# EAGLE design ina219 (EAGLE 9.3.0)
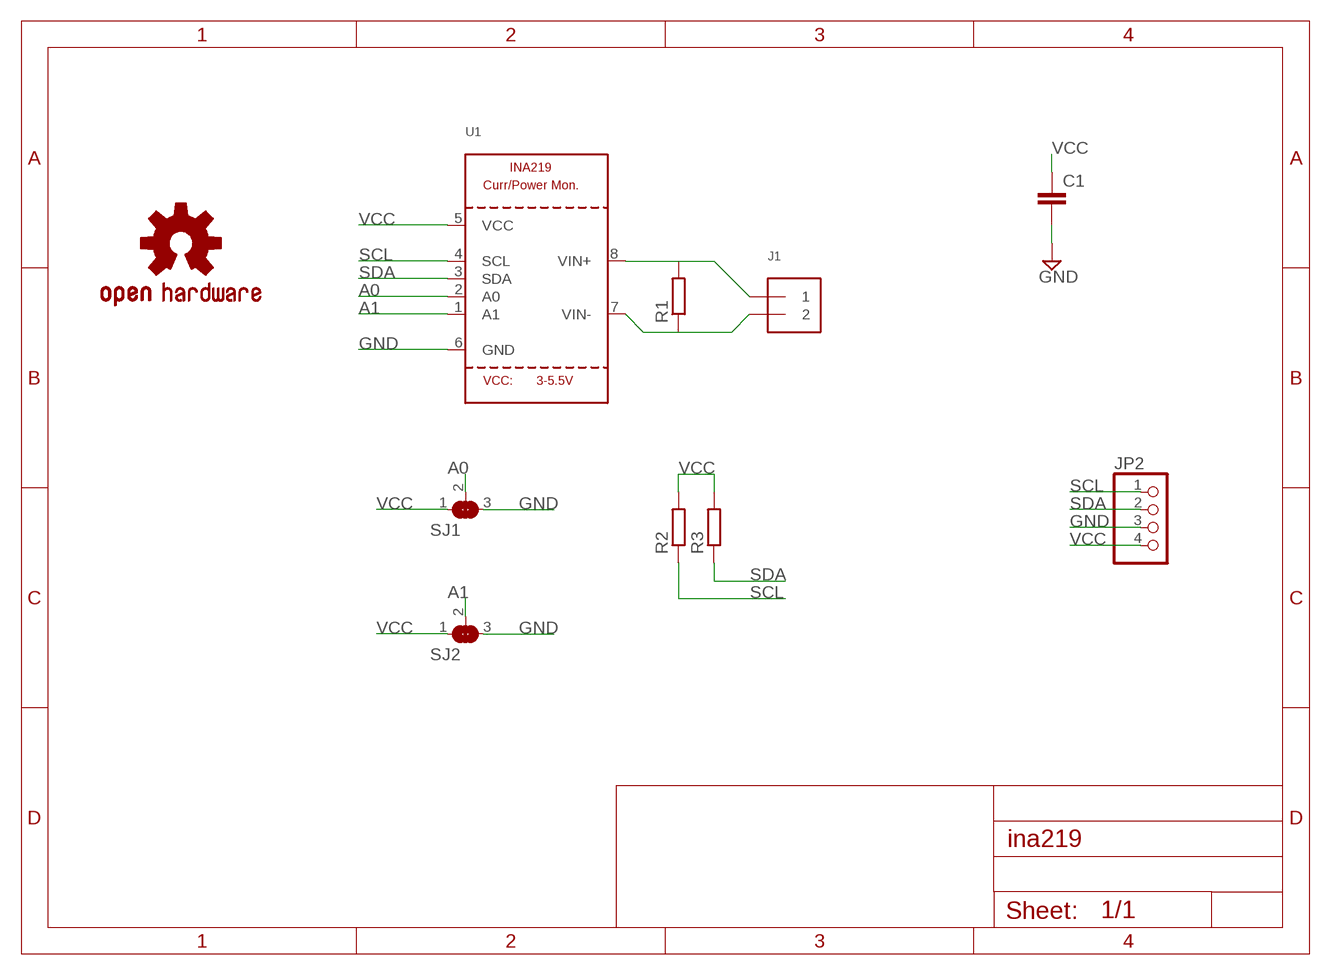
[diagram p0: schematic, sheet 1]

## Parts
C1  C-EUC0805  [C0805]
J1  TERMBLOCK_1X2  [TERMBLOCK_1X2-3.5MM]
JP2  PINHD-1X4  [1X04]
LOGO1  OSHW-LOGOS  [OSHW-LOGO-S]
R1  R-EU_R1206  [R1206]
R2  R-EU_R0805  [R0805]
R3  R-EU_R0805  [R0805]
SJ1  SOLDERJUMPER_2WAY0603  [SOLDERJUMPER_2WAY_OPEN_0603]
SJ2  SOLDERJUMPER_2WAY0603  [SOLDERJUMPER_2WAY_OPEN_0603]
U1  INA219SOIC8  [SOIC8_150MIL]

## Nets
A0: SJ1.2 U1.2(A0)
A1: SJ2.2 U1.1(A1)
GND: C1.2 JP2.3 SJ1.3 SJ2.3 U1.6(GND)
N$7: J1.1 R1.2 U1.8(VIN+)
N$8: J1.2 R1.1 U1.7(VIN-)
SCL: JP2.1 R2.1 U1.4(SCL)
SDA: JP2.2 R3.1 U1.3(SDA)
VCC: C1.1 JP2.4 R2.2 R3.2 SJ1.1 SJ2.1 U1.5(VCC)

## Library data of the parts
C1 = rcl:C-EU: CAPACITOR, European symbol
J1 = microbuilder:TERMBLOCK_1X2: 3.5mm Terminal block http://www.ladyada.net/library/pcb/eaglelibrary.html
JP2 = pinhead:PINHD-1X4: PIN HEADER
LOGO1 = SparkFun-Aesthetics:OSHW-LOGO: Open Source Hardware Logo This logo indicates the piece of hardware it is found on incorporates a OSHW license and/or adheres to the definition of open source hardware found here: http://freedomdefined.org/OSHW
R1-R3 = rcl:R-EU_: RESISTOR, European symbol
SJ1 SJ2 = microbuilder:SOLDERJUMPER_2WAY: 2-Way Solder Jumper
U1 = microbuilder:INA219: INA219 - I2C Current/Power Monitor Voltage Range: 0-26V Accuracy: 0.5% Temperature: -40°C - 125°C

## Board
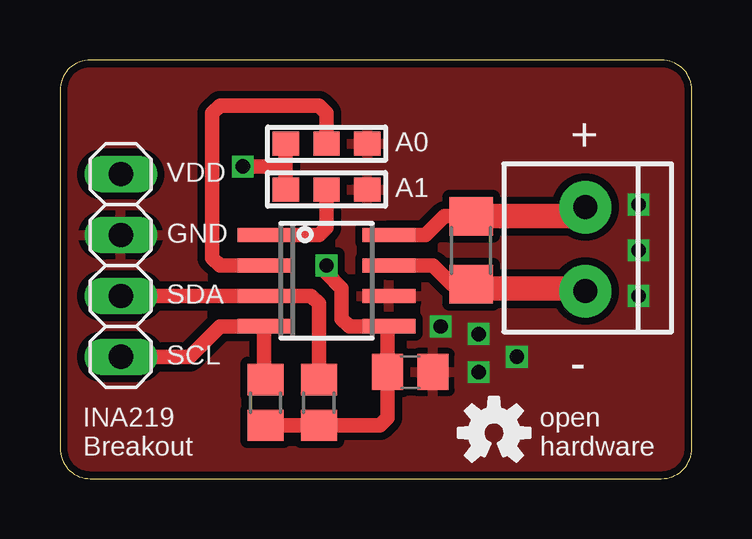
[diagram p1: board, top side]
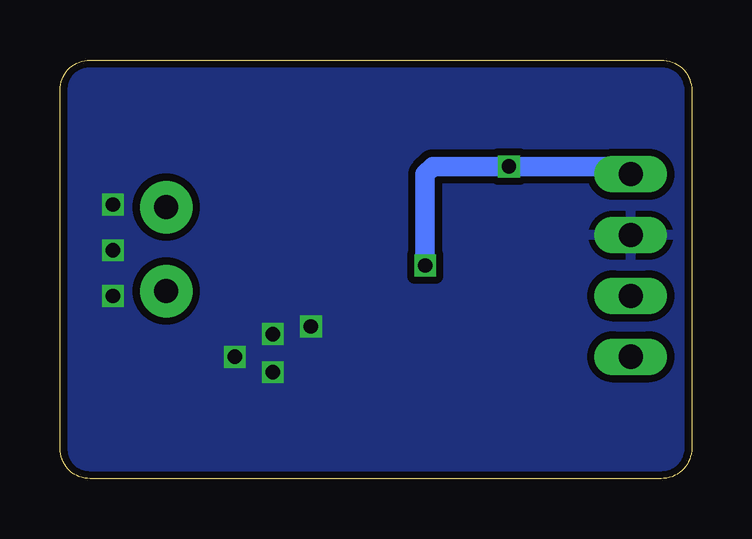
[diagram p2: board, bottom side, seen from below]

Size 26.34 x 17.46 mm. Coordinates in mm from the lower left corner, seen from the top.
Outline: 0,1.27 arc90 1.27,0 25.08,0 arc90 26.34,1.26 26.34,16.2 arc90 25.08,17.46 1.27,17.46 arc90 0,16.19 0,1.27
Copper layers (1*16): Top 0.035mm / dielectric 1.5mm / Bottom 0.035mm
Design rules "Fusion_eagle_rule_v1.1": minimum track width 6mil, minimum drill 12mil, track to track 6mil, track to pad 6mil, pad to pad 6mil, via to via 6mil, smd to smd 0mil, copper to edge 10mil, drill to drill 10mil, minimum pad ring 10mil, minimum via ring 6mil, stop-mask expansion 2mil, vias tented up to drill 100mil, thermal gap 10mil

### Footprints (pad centres in the part's own frame; a part is rotated, then mirrored left to right if it is on the bottom)
C0805 = smd 1.3 x 1.5: 1 -0.95,0; 2 0.95,0
TERMBLOCK_1X2-3.5MM = drill 1 pad 2.184: 1 1.8,0; 2 -1.7,0
1X04 = drill 1.016 long: 1 -3.81,0; 2 -1.27,0; 3 1.27,0; 4 3.81,0
R1206 = smd 1.6 x 1.803: 1 -1.422,0; 2 1.422,0
R0805 = smd 1.3 x 1.5: 1 -0.95,0; 2 0.95,0
SOLDERJUMPER_2WAY_OPEN_0603 = smd 1.1 x 1: 1 -1.7,0; 2 0,0; 3 1.7,0
SOIC8_150MIL = smd 0.6 x 2.2: 1 -1.905,-2.6; 2 -0.635,-2.6; 3 0.635,-2.6; 4 1.905,-2.6; 5 1.905,2.6; 6 0.635,2.6; 7 -0.635,2.6; 8 -1.905,2.6

### Placement (x,y rotation side)
C1  14.61,4.45 0 top
J1  21.91,9.53 90 top
JP2  2.54,8.89 90 top
LOGO1  18.1,1.91 0 top
R1  17.14,9.53 90 top
R2  8.57,3.17 270 top
R3  10.79,3.17 270 top
SJ1  11.11,13.97 0 top
SJ2  11.11,12.06 0 top
U1  11.11,8.26 270 top

### Tracks (layer width: path | path; a pad name or v marks a point on that pad's centre or on a via)
A0
  Top 0.61: U1.2 6.67,8.89 6.35,9.21 6.35,15.24 6.67,15.56 10.79,15.56 11.11,15.24 SJ1.2
A1
  Top 0.61: U1.1 10.79,10.16 11.11,10.48 SJ2.2
GND  (via drill 0.6)
  other vias: 17.46,6.03 24.13,9.53 15.88,6.35 17.46,4.45 19.05,5.08 24.13,7.62 24.13,11.43
  pour Top (isolate 0.305): 26.35,17.46 0,17.46 0,0 26.35,0
  pour Bottom (isolate 0.305): -0.32,17.78 26.67,17.78 26.67,-0.32 -0.32,-0.32
N$7
  Top 0.61: R1.2 16.03,10.95 15.24,10.16 U1.8
  Top 1.016: R1.2 21.53,10.95 J1.1
N$8
  Top 0.406: 17.3,7.94 R1.1
  Top 0.61: 17.42,7.83 R1.1 16.34,8.1 15.56,8.89 U1.7
  Top 1.016: 17.3,7.94 21.8,7.94 J1.2
SCL
  Top 0.61: R2.1 8.51,4.18 U1.4 6.67,6.35 5.4,5.08 JP2.1
SDA
  Top 0.61: R3.1 10.79,7.3 10.48,7.62 U1.3 JP2.2
VCC  (via drill 0.6)
  Top 0.61: SJ1.1 SJ2.1 9.41,12.81 9.21,13.02 v7.62,13.02 | R2.2 R3.2 13.34,2.22 13.65,2.54 C1.1 13.65,6.29 U1.5 12.06,6.35 11.75,6.67 11.75,7.94 11.11,8.57 v11.11,8.89
  Bottom 0.813: v11.11,8.89 11.11,12.7 10.79,13.02 v7.62,13.02 2.86,13.02 JP2.4

### Text on the board
tNames: A0 | + | VDD | A1 | GND | SDA | SCL | - | INA219 / Breakout | open / hardware